# EAGLE design Helepolis_Level2 (EAGLE 6.4)
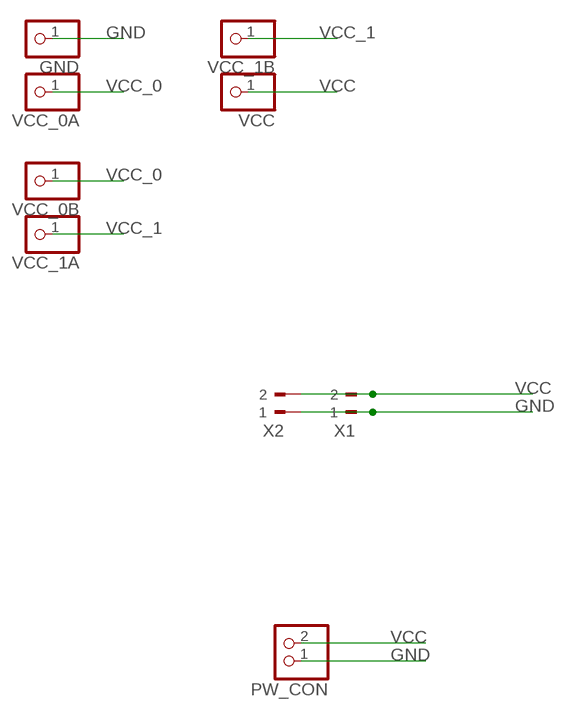
[diagram p0: schematic, sheet 1]

## Parts
GND  PINHD-1X1  [1X01]
PW_CON  PINHD-1X2  [1X02]
VCC  PINHD-1X1  [1X01]
VCC_0A  PINHD-1X1  [1X01]
VCC_0B  PINHD-1X1  [1X01]
VCC_1A  PINHD-1X1  [1X01]
VCC_1B  PINHD-1X1  [1X01]
X1  90-2  [90-2]
X2  90-2  [90-2]

## Nets
GND [GND]: GND.1 PW_CON.1 X1.1 X2.1
VCC [GND]: PW_CON.2 VCC.1 X1.2 X2.2
VCC_0 [VCC]: VCC_0A.1 VCC_0B.1
VCC_1 [VCC]: VCC_1A.1 VCC_1B.1

## Library data of the parts
GND VCC VCC_0A VCC_0B VCC_1A VCC_1B = pinhead:PINHD-1X1: PIN HEADER
PW_CON = pinhead:PINHD-1X2: PIN HEADER
X1 X2 = con-weidmueller-sl35:90-2: WEIDMUELLER CLAMP CONNECTOR; OC_FARNELL: unknown; OC_NEWARK: unknown

## Net classes
1 GND: width 1.016 mm, clearance 0.305 mm
2 VCC: width 1.016 mm, clearance 0.305 mm to class 1

## Board
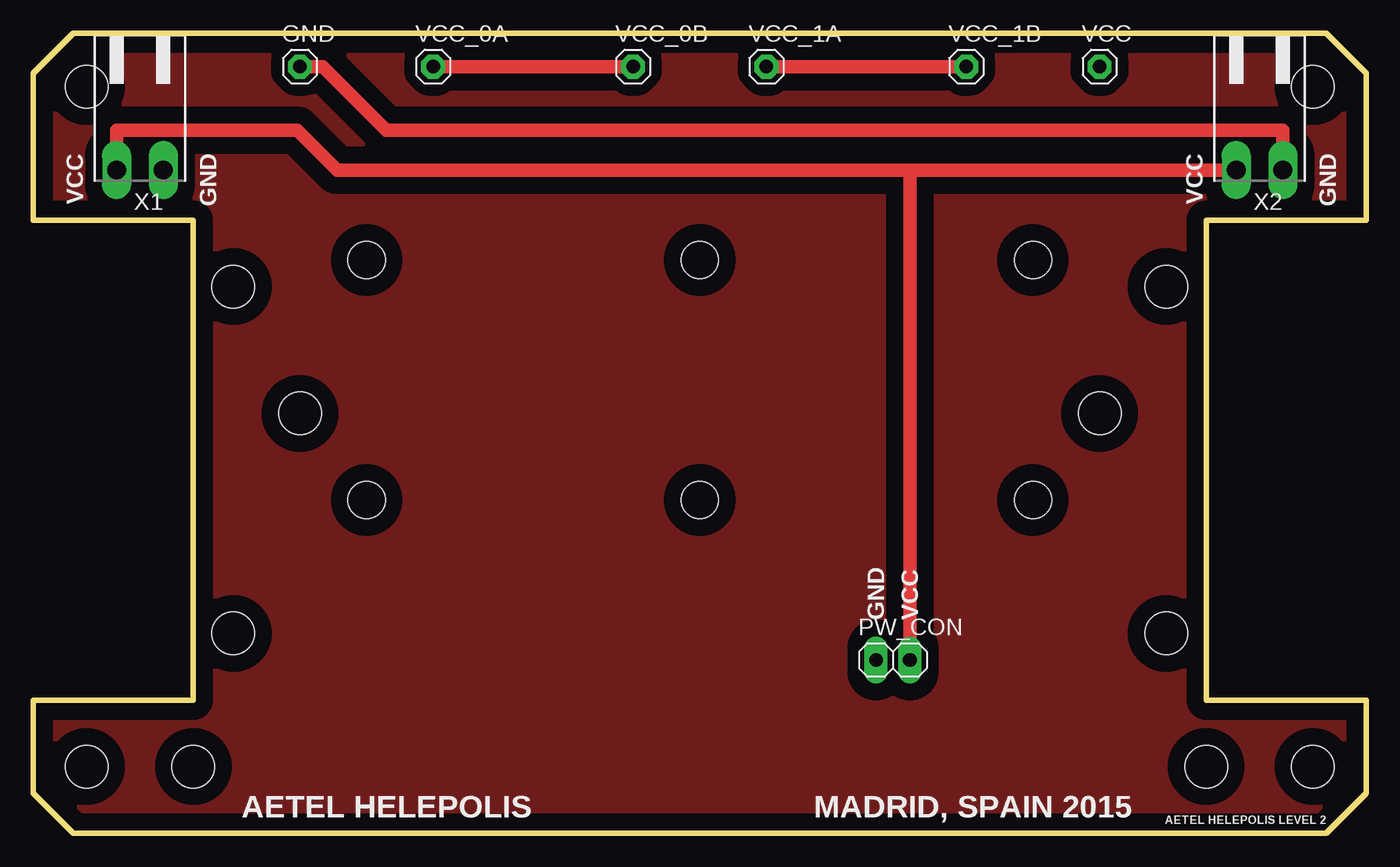
[diagram p1: board, top side]
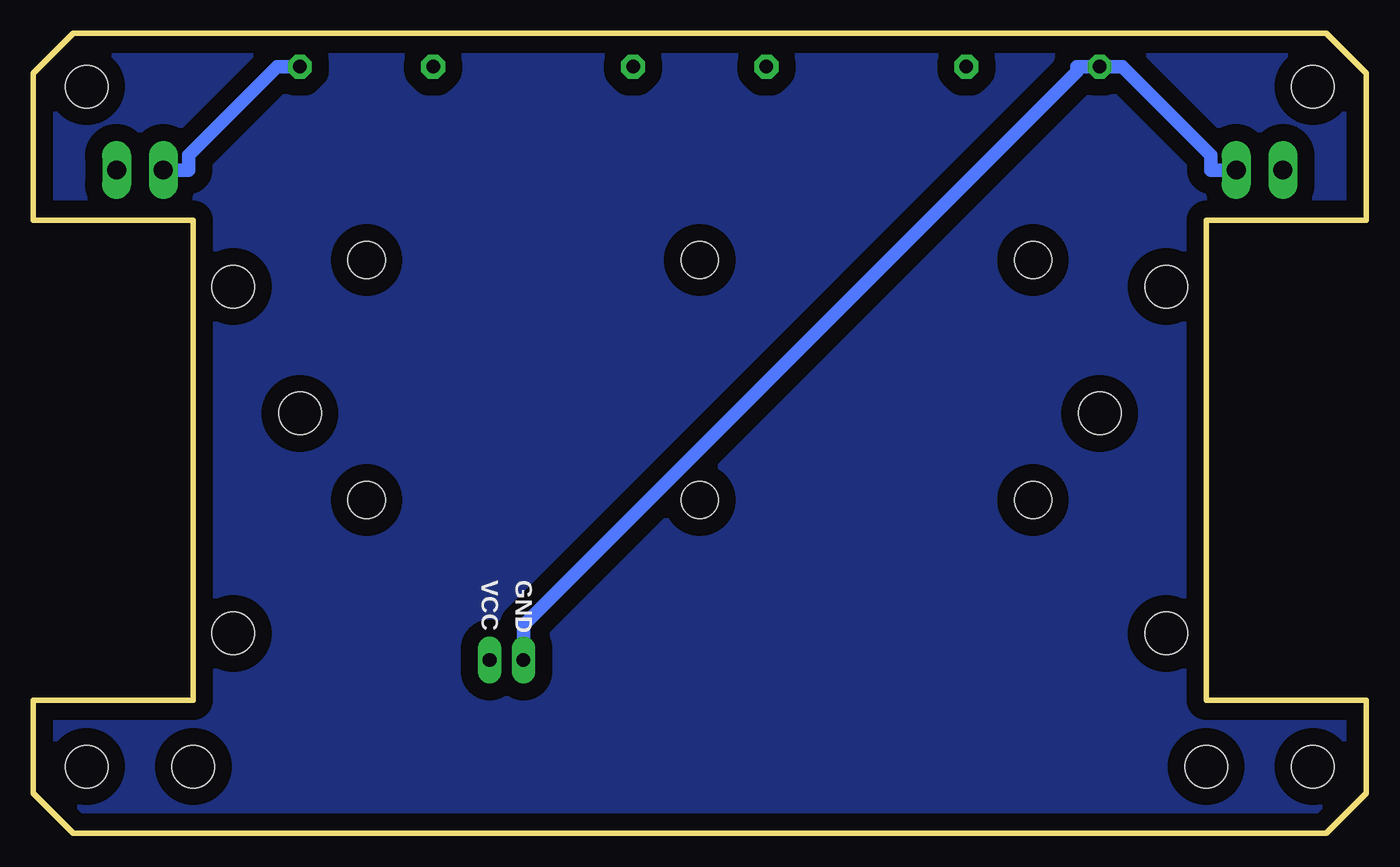
[diagram p2: board, bottom side, seen from below]

Size 100 x 60 mm. Coordinates in mm from the lower left corner, seen from the top.
Outline: 3,0 27,0
Outline: 73,0 97,0
Outline: 100,3 100,10
Outline: 0,10 0,3
Outline: 0,3 0,10
Outline: 88,46 88,45
Outline: 88,45 88,43 88,25 88,10 100,10
Outline: 100,10 100,3
Outline: 97,0 73,0
Outline: 27,0 3,0
Outline: 0,10 12,10 12,25 12,43 12,46 0,46 0,57 3,60 97,60 100,57 100,46 88,46
Outline: 0,3 3,0
Outline: 100,3 97,0
Outline: 73,0 67,0 51,0 35,0 28,0 27,0
Outline: 88,46 88,45
Outline: 88,45 88,46
Copper layers (1*16): Top 0.035mm / dielectric 1.5mm / Bottom 0.035mm
Design rules "default *": minimum track width 15mil, minimum drill 24mil, track to track 12mil, track to pad 12mil, pad to pad 12mil, via to via 12mil, smd to smd 8mil, copper to edge 40mil, drill to drill 8mil, minimum pad ring 15mil, minimum via ring 15mil, stop-mask expansion 4mil, vias tented up to drill 0mil, thermal gap 10mil
Holes 3.2 mm at 4,5 12,5 20,31.5 96,5 88,5 85,41 85,15 15,41 4,56 96,56 80,31.5 15,15
Holes 2.8 mm at 75,25 75,43 50,25 50,43 25,25 25,43

### Footprints (pad centres in the part's own frame; a part is rotated, then mirrored left to right if it is on the bottom)
1X01 = drill 1.016 octagon: 1 0,0
1X02 = drill 1.016 long: 1 -1.27,0; 2 1.27,0
90-2 = drill 1.422 long: 1 -1.75,5.25; 2 1.75,5.25

### Placement (x,y rotation side)
GND  20,57.5 0 top
PW_CON  64.5,13 0 top
VCC  80,57.5 0 top
VCC_0A  30,57.5 0 top
VCC_0B  45,57.5 0 top
VCC_1A  55,57.5 0 top
VCC_1B  70,57.5 0 top
X1  8,55 180 top
X2  92,55 180 top

### Tracks (layer width: path | path; a pad name or v marks a point on that pad's centre or on a via)
GND
  Top 1.016: GND.1 21.7,57.5 26.45,52.75 93.75,52.75 X2.1
  Bottom 1.016: PW_CON.1 63.23,15.59 21.7,57.12 21.7,57.5 GND.1 18.3,57.5 11.65,50.86 11.65,49.75 X1.1
N$1
  pour Top (isolate 1.27): 0,10 0,3 3,0 97,0 100,3 100,10 88,10 88,46 100,46 100,57 97,60 3,60 0,57 0,46 12,46 12,10
N$2
  pour Bottom (isolate 1.27): 0,57 0,47 0,46 12,46 12,10 0,10 0,3 3,0 97,0 100,3 100,10 88,10 88,46 100,46 100,57 97,60 3,60
VCC
  Top 1.016: 65.77,49.75 X2.2 | 65.77,49.75 22.8,49.75 19.8,52.75 6.25,52.75 X1.2 | 65.77,49.75 PW_CON.2
  Bottom 1.016: X2.2 88.34,49.75 88.34,50.86 81.7,57.5 VCC.1
VCC_0
  Top 1.016: VCC_0B.1 VCC_0A.1
VCC_1
  Top 1.016: VCC_1B.1 VCC_1A.1

### Text on the board
_tsilk: VCC | GND | VCC | GND | GND / VCC | AETEL HELEPOLIS | MADRID, SPAIN 2015 | AETEL HELEPOLIS LEVEL 2
_bsilk: GND / VCC